# EAGLE design divchrono-aux (EAGLE 7.5.0)
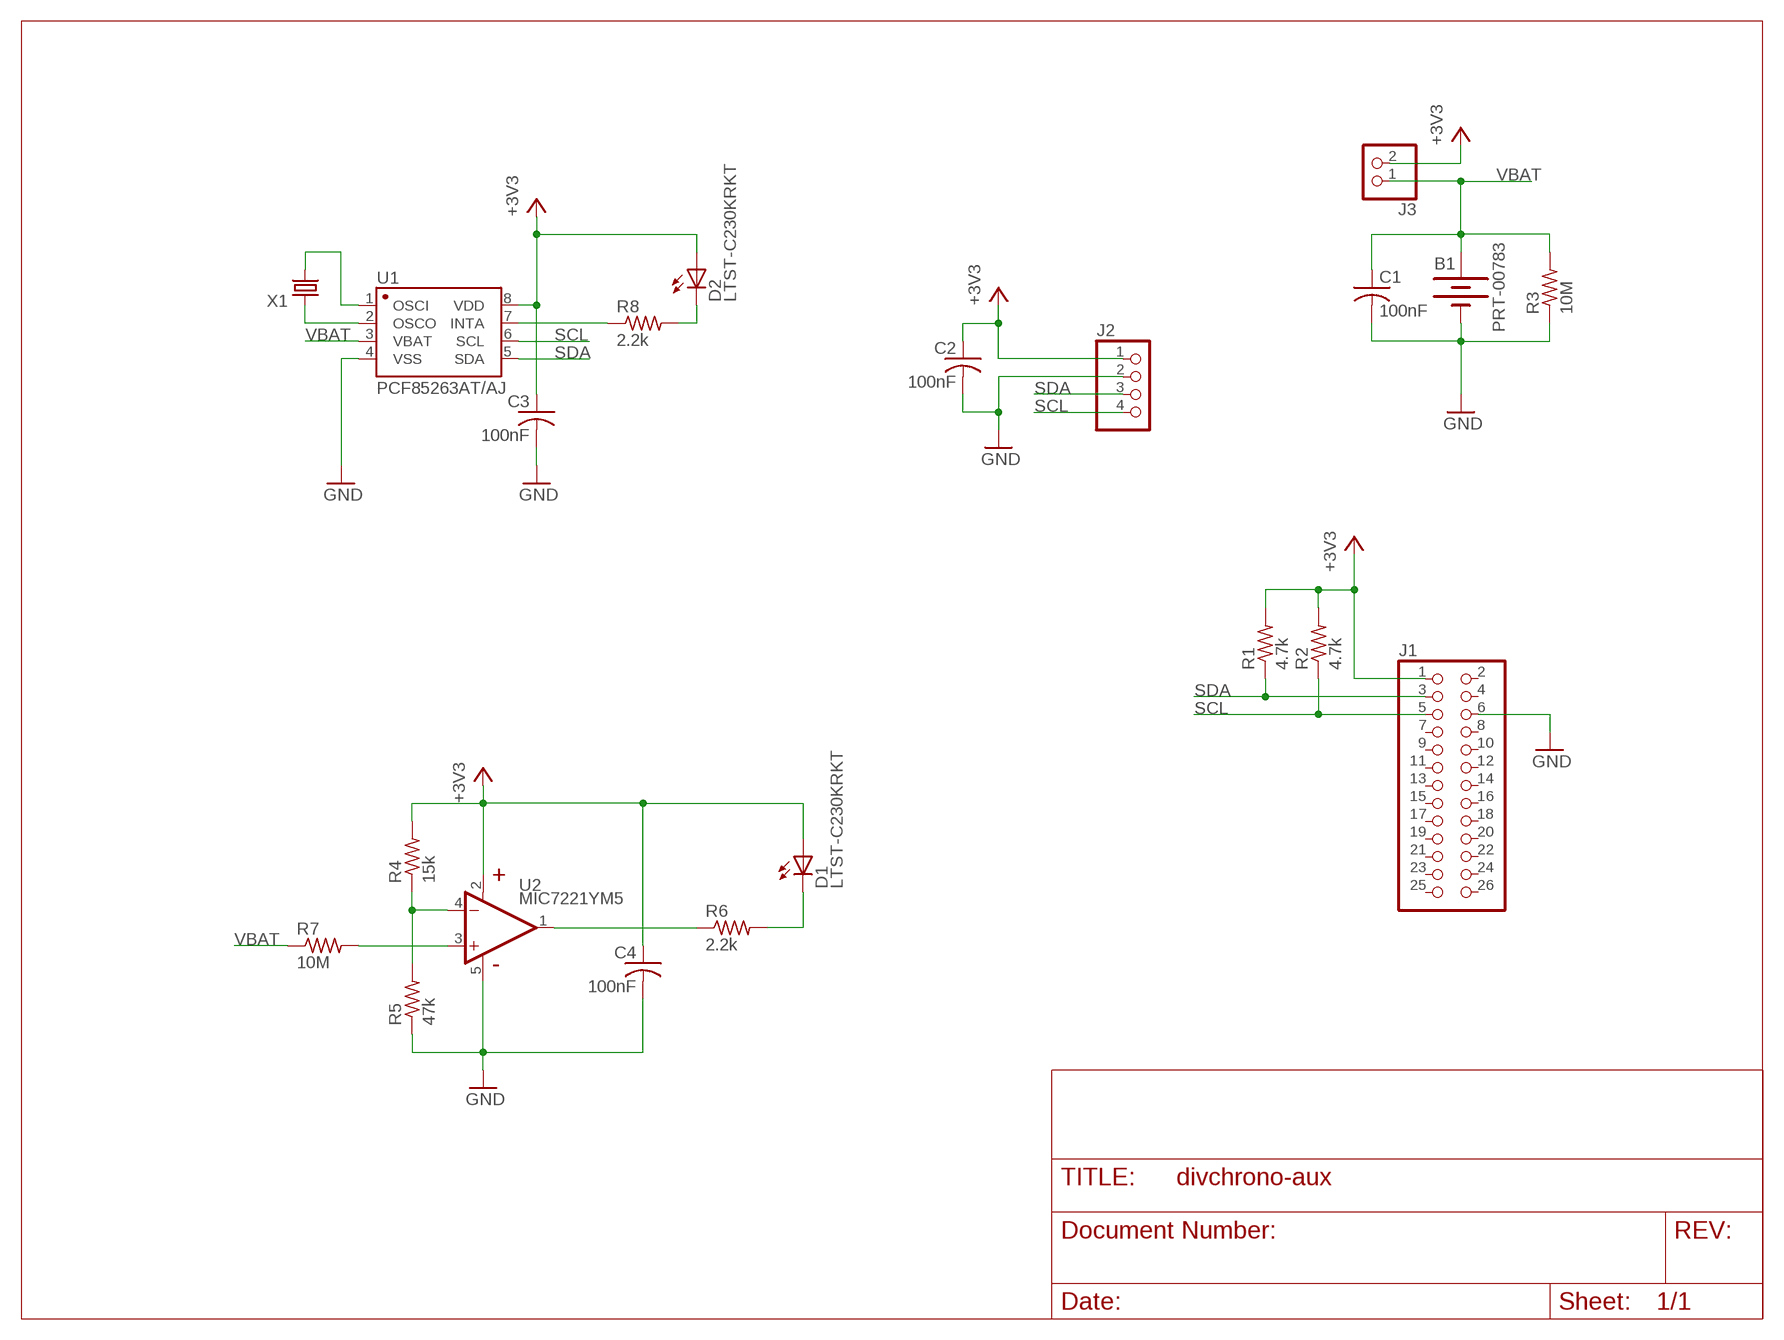
[diagram p0: schematic, sheet 1]

## Parts
B1  PRT-00783  BATTERY20PTH  [BATTCOM_20MM_PTH]
C1  100nF  C-USC1206  [C1206]
C2  100nF  C-USC1206  [C1206]
C3  100nF  C-USC1206  [C1206]
C4  100nF  C-USC1206  [C1206]
D1  LTST-C230KRKT  LEDCHIPLED_1206  [CHIPLED_1206]
D2  LTST-C230KRKT  LEDCHIPLED_1206  [CHIPLED_1206]
J1  PINHD-2X13  [2X13]
J2  PINHD-1X4  [1X04]
J3  PINHD-1X2  [1X02]
R1  4.7k  R-US_R1206  [R1206]
R2  4.7k  R-US_R1206  [R1206]
R3  10M  R-US_R1206  [R1206]
R4  15k  R-US_R1206  [R1206]
R5  47k  R-US_R1206  [R1206]
R6  2.2k  R-US_R1206  [R1206]
R7  10M  R-US_R1206  [R1206]
R8  2.2k  R-US_R1206  [R1206]
U1  PCF85263AT/AJ  PCF85263  [SOIC-8]
U2  MIC7221YM5  [SOT23-5]
X1  CRYSTALS-NOGND-WATCH-3X8  [WATCH-3X8]

## Nets
+3V3: C2.1 C3.1 C4.1 D1.A D2.A J1.1 J2.1 J3.2 R1.2 R2.2 R4.2 U1.8(VDD) U2.2(V+)
GND: B1.2(-) C1.2 C2.2 C3.2 C4.2 J1.6 J2.2 R3.1 R5.1 U1.4(VSS) U2.5(V-)
N$1: R6.1 U2.1(OUT)
N$2: R4.1 R5.2 U2.4(-IN)
N$3: D1.C R6.2
N$4: U1.2(OSCO) X1.1
N$5: U1.1(OSCI) X1.2
N$6: R7.2 U2.3(+IN)
N$7: D2.C R8.2
N$8: R8.1 U1.7(INTA)
SCL: J1.5 J2.4 R2.1 U1.6(SCL)
SDA: J1.3 J2.3 R1.1 U1.5(SDA)
VBAT: B1.1(+) C1.1 J3.1 R3.2 R7.1 U1.3(VBAT)
Unconnected: J1.2 J1.4 J1.7 J1.8 J1.9 J1.10 J1.11 J1.12 J1.13 J1.14 J1.15 J1.16 J1.17 J1.18 J1.19 J1.20 J1.21 J1.22 J1.23 J1.24 J1.25 J1.26

## Library data of the parts
B1 = SparkFun-Electromechanical:BATTERY: Battery Holders Various common sizes : AA, AAA, 18650 (PRT-12895), 20mm coin cell and 12mm coin cell. 20MM_4LEGS, BATT-10373
C1-C4 = rcl:C-US: CAPACITOR, American symbol
D1 D2 = led:LED: LED OSRAM: - CHIPLED LG R971, LG N971, LY N971, LG Q971, LY Q971, LO R971, LY R971 LH N974, LH R974 LS Q976, LO Q976, LY Q976 LO Q996 - Hyper CHIPLED LW Q18S LB Q993, LB Q99A, LB R99A - SideLED LS A670, LO A670, LY A670, LG A670, LP A670 LB A673, LV A673, LT A673, LW A673 LH A674 LY A675 LS A676, LA A676, LO A676, LY A676, LW A676 LS A679, LY A679, LG A679 - Hyper Micro SIDELED® LS Y876, LA Y876, LO Y876, LY Y876 LT Y87S - SmartLED LW L88C, LW L88S LB L89C, LB L89S, LG L890 LS L89K, LO L89K, LY L89K LS L896, LA L896, LO L896, LY L896 - TOPLED LS T670, LO T670, LY T670, LG T670, LP T670 LSG T670, LSP T670, LSY T670, LOP T670, LYG T670 LG T671, LOG T671, LSG T671 LB T673, LV T673, LT T673, LW T673 LH T674 LS T676, LA T676, LO T676, LY T676, LB T676, LH T676, LSB T676, LW T676 LB T67C, LV T67C, LT T67C, LS T67K, LO T67K, LY T67K, LW E67C LS E67B, LA E67B, LO E67B, LY E67B, LB E67C, LV E67C, LT E67C LW T67C LS T679, LY T679, LG T679 LS T770, LO T770, LY T770, LG T770, LP T770 LB T773, LV T773, LT T773, LW T773 LH T774 LS E675, LA E675, LY E675, LS T675 LS T776, LA T776, LO T776, LY T776, LB T776 LHGB T686 LT T68C, LB T68C - Hyper Mini TOPLED® LB M676 - Mini TOPLED Santana® LG M470 LS M47K, LO M47K, LY M47K Source: http://www.osram.convergy.de LUXEON: - LUMILED® LXK2-PW12-R00, LXK2-PW12-S00, LXK2-PW14-U00, LXK2-PW14-V00 LXK2-PM12-R00, LXK2-PM12-S00, LXK2-PM14-U00 LXK2-PE12-Q00, LXK2-PE12-R00, LXK2-PE12-S00, LXK2-PE14-T00, LXK2-PE14-U00 LXK2-PB12-K00, LXK2-PB12-L00, LXK2-PB12-M00, LXK2-PB14-N00, LXK2-PB14-P00, LXK2-PB14-Q00 LXK2-PR12-L00, LXK2-PR12-M00, LXK2-PR14-Q00, LXK2-PR14-R00 LXK2-PD12-Q00, LXK2-PD12-R00, LXK2-PD12-S00 LXK2-PH12-R00, LXK2-PH12-S00 LXK2-PL12-P00, LXK2-PL12-Q00, LXK2-PL12-R00 Source: www.luxeon.com KINGBRIGHT: KA-3528ASYC Source: www.kingbright.com
J1 = pinhead:PINHD-2X13: PIN HEADER
J2 = pinhead:PINHD-1X4: PIN HEADER
J3 = pinhead:PINHD-1X2: PIN HEADER
R1-R8 = rcl:R-US_: RESISTOR, American symbol
U1 = divchrono:PCF85263
U2 = divchrono:MIC7221YM5
X1 = pgrmcount:CRYSTALS-NOGND: CRYSTALS CAN NOT GROUNDED

## Board
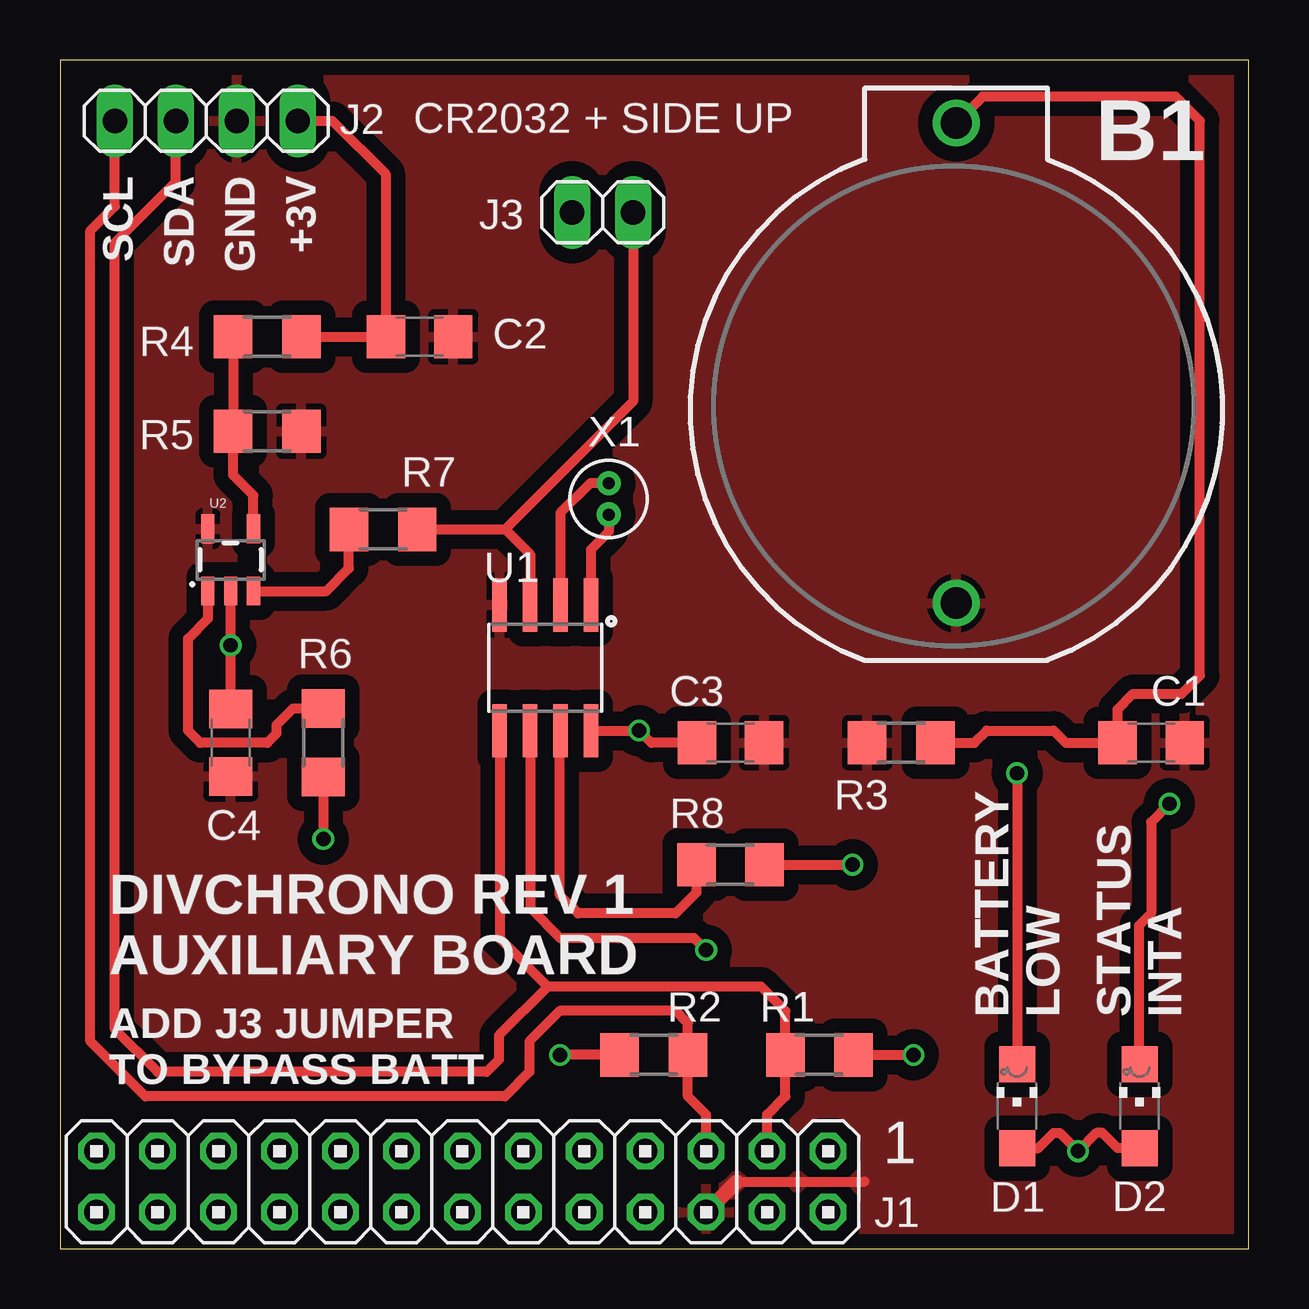
[diagram p1: board, top side]
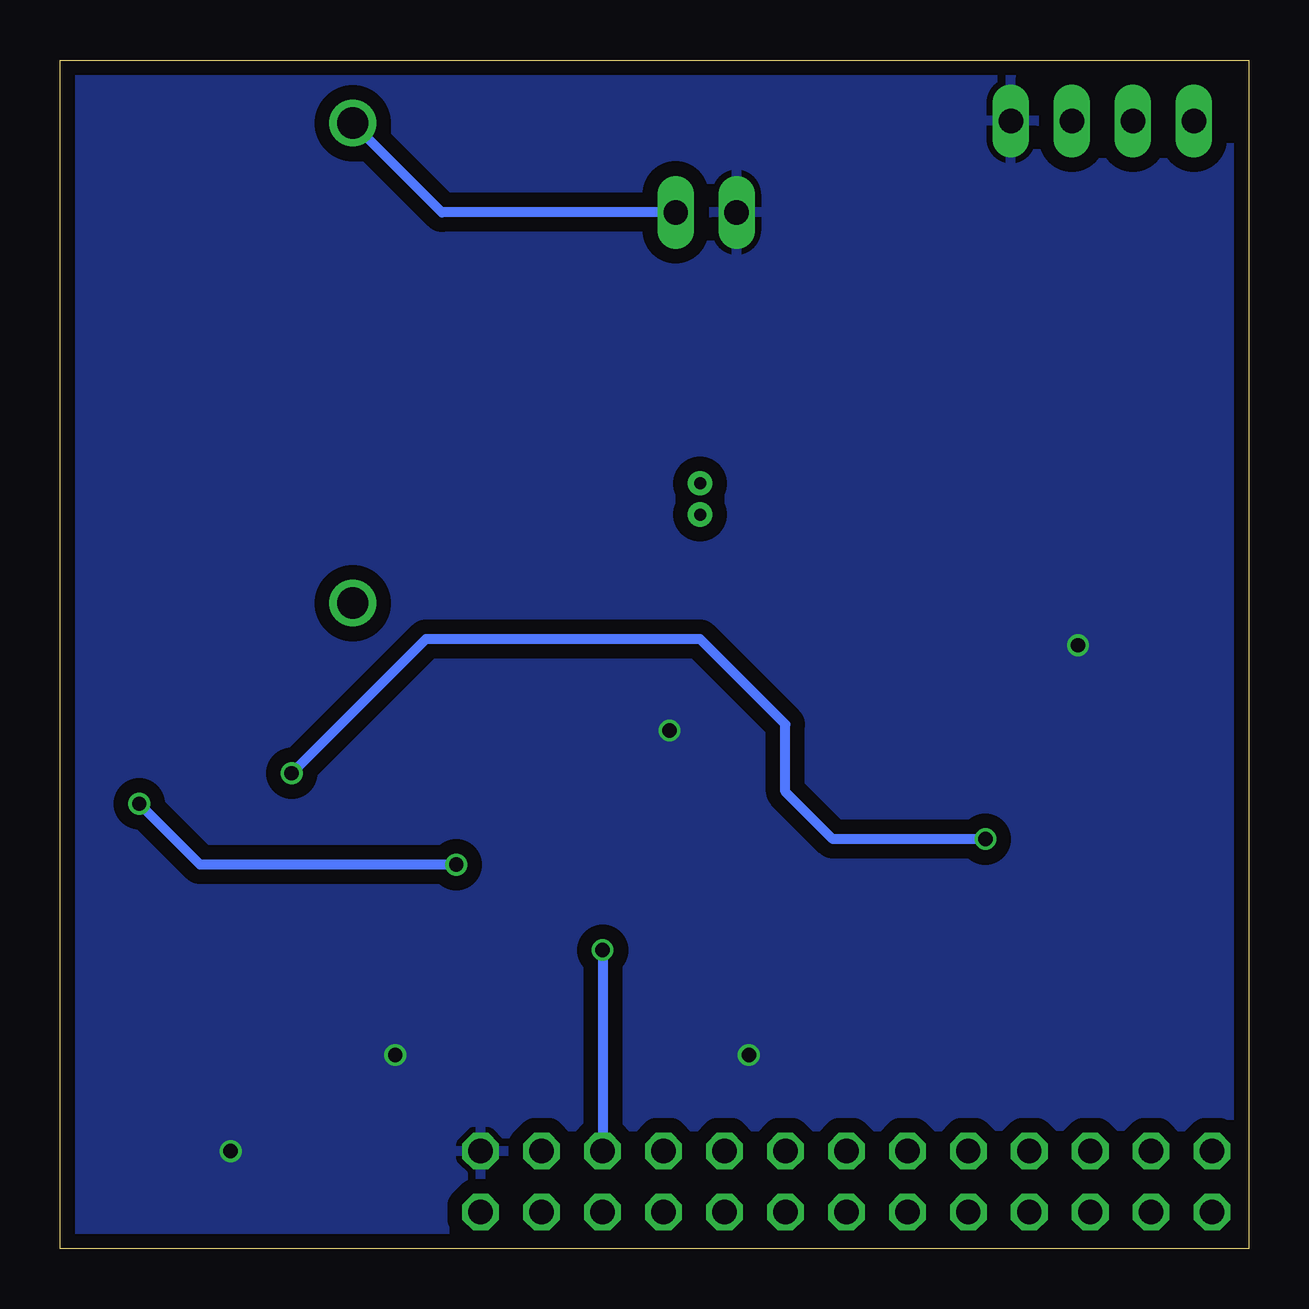
[diagram p2: board, bottom side, seen from below]

Size 49.53 x 49.53 mm. Coordinates in mm from the lower left corner, seen from the top.
Outline: 0,0 49.53,0 49.53,49.53 0,49.53 0,0
Copper layers (1*16): Top 0.035mm / dielectric 1.5mm / Bottom 0.035mm
Design rules "dirt_cheap_dirty_boards.v1": minimum track width 5mil, minimum drill 12mil, track to track 5mil, track to pad 5mil, pad to pad 5mil, via to via 5mil, smd to smd 0mil, copper to edge 10mil, drill to drill 10mil, minimum pad ring 10mil, minimum via ring 6mil, stop-mask expansion 2mil, vias tented up to drill 25mil, thermal gap 10mil

### Footprints (pad centres in the part's own frame; a part is rotated, then mirrored left to right if it is on the bottom)
BATTCOM_20MM_PTH = drill 1.3: 1 11.85,0; 2 -8.15,0
C1206 = smd 1.6 x 1.8: 1 -1.4,0; 2 1.4,0
CHIPLED_1206 = smd 1.5 x 1.5: A 0,-1.75; C 0,1.75
2X13 = drill 1.016 octagon: 1 -15.24,-1.27; 2 -15.24,1.27; 3 -12.7,-1.27; 4 -12.7,1.27; 5 -10.16,-1.27; 6 -10.16,1.27; 7 -7.62,-1.27; 8 -7.62,1.27; 9 -5.08,-1.27; 10 -5.08,1.27; 11 -2.54,-1.27; 12 -2.54,1.27; 13 0,-1.27; 14 0,1.27; 15 2.54,-1.27; 16 2.54,1.27; 17 5.08,-1.27; 18 5.08,1.27; 19 7.62,-1.27; 20 7.62,1.27; 21 10.16,-1.27; 22 10.16,1.27; 23 12.7,-1.27; 24 12.7,1.27; 25 15.24,-1.27; 26 15.24,1.27
1X04 = drill 1.016 long: 1 -3.81,0; 2 -1.27,0; 3 1.27,0; 4 3.81,0
1X02 = drill 1.016 long: 1 -1.27,0; 2 1.27,0
R1206 = smd 1.6 x 1.803: 1 -1.422,0; 2 1.422,0
SOIC-8 = smd 0.61 x 2.21: 1 -1.905,-2.616; 2 -0.635,-2.616; 3 0.635,-2.616; 4 1.905,-2.616; 5 1.905,2.616; 6 0.635,2.616; 7 -0.635,2.616; 8 -1.905,2.616
SOT23-5 = smd 0.55 x 1.2: 1 -0.95,-1.3; 2 0,-1.3; 3 0.95,-1.3; 4 0.95,1.3; 5 -0.95,1.3
WATCH-3X8 = drill 0.5 pad 0.813: 1 -0.652,0; 2 0.652,0

### Placement (x,y rotation side)
B1  37.34,35.05 90 top
C1  45.47,21.08 0 top
C2  14.99,38 0 top
C3  27.94,21.08 0 top
C4  7.11,21.08 270 top
D1  39.88,5.94 0 top
D2  44.98,5.94 0 top
J1  16.76,2.79 180 top
J2  6.1,46.99 180 top
J3  22.61,43.18 180 top
R1  31.65,8.08 0 top
R2  24.74,8.08 180 top
R3  35.05,21.08 0 top
R4  8.64,38 0 top
R5  8.64,34.06 180 top
R6  10.97,21.08 270 top
R7  13.46,29.97 180 top
R8  27.94,16 0 top
U1  20.22,24.21 180 top
U2  7.11,28.7 0 top
X1  22.86,31.24 270 top

### Tracks (layer width: path | path; a pad name or v marks a point on that pad's centre or on a via)
+3V3  (via drill 0.6)
  Top 0.406: R2.2 v20.83,8.08 | R1.2 v35.56,8.08 | U1.8 v24.13,21.59 24.64,21.08 C3.1 | C4.1 v7.11,25.15 U2.2 | R4.2 C2.1 13.56,38.02 13.56,44.78 11.35,46.99 J2.1 | D1.A 40.77,4.19 41.4,4.83 41.66,4.83 v42.42,4.06 43.18,4.83 43.43,4.83 44.07,4.19 D2.A
  pour Bottom (isolate 0.61): 0,49.53 0,0 49.53,0 49.53,49.53
GND
  Top 0.406: 28.19,2.79 33.53,2.79
  Top 0.61: J1.6 28.19,2.79
  pour Top (isolate 0.61): 0,49.53 49.53,49.53 49.53,0 0,0
N$1
  Top 0.406: R6.1 9.7,22.5 9.02,21.82 9.02,21.46 8.64,21.08 5.84,21.08 5.33,21.59 5.33,25.43 6.17,26.26 6.17,27.39 U2.1
N$2
  Top 0.406: R4.1 R5.2 | U2.4 8.06,31.38 7.21,32.23 R5.2 | R5.2
N$3  (via drill 0.6)
  Top 0.406: R6.2 v10.97,17.07 | v39.88,19.81 D1.C
  Bottom 0.406: v10.97,17.07 17.32,17.07 19.3,19.05 19.3,21.84 22.86,25.4 34.29,25.4 v39.88,19.81
N$4
  Top 0.406: X1.1 22.09,31.89 20.85,30.66 U1.2
N$5
  Top 0.406: X1.2 22.86,29.87 22.12,29.13 U1.1
N$6
  Top 0.406: U2.3 11.1,27.4 12.04,28.35 R7.2 | R7.2
N$7  (via drill 0.6)
  Top 0.406: R8.2 v33.02,16 | D2.C 44.96,7.72 44.96,13.46 45.47,13.97 45.47,17.78 v46.23,18.54
  Bottom 0.406: v33.02,16 43.69,16 v46.23,18.54
N$8
  Top 0.406: R8.1 26.52,14.83 25.65,13.97 21.59,13.97 20.83,14.73 20.83,21.57 U1.7
SCL  (via drill 0.6)
  Top 0.406: J1.5 26.92,5.59 26.16,6.35 R2.1 | R2.1 | J2.4 2.29,43.43 1.27,42.42 1.27,8.64 3.56,6.35 18.54,6.35 19.56,7.37 19.56,8.64 20.83,9.91 25.65,9.91 26.16,9.4 R2.1 | U1.6 19.58,14.2 20.83,12.95 26.42,12.95 v26.92,12.45
  Bottom 0.406: v26.92,12.45 J1.5
SDA
  Top 0.406: J1.3 29.46,5.59 30.23,6.35 R1.1 | R1.1 | J2.3 4.83,44.45 2.29,41.91 2.29,9.14 4.06,7.37 17.78,7.37 18.29,7.87 18.29,8.89 20.32,10.92 | R1.1 30.23,9.91 29.21,10.92 20.32,10.92 | U1.5 18.31,12.93 20.32,10.92
VBAT
  Top 0.406: C1.1 44.07,22.48 44.7,23.11 46.74,23.11 47.5,23.88 47.5,46.99 46.48,48.01 38.44,48.01 B1.1 | R7.1 18.54,29.97 | 18.54,29.97 19.58,28.93 U1.3 | 44.04,21.06 C1.1 | J3.1 23.88,35.31 18.54,29.97 | R3.2 38.1,21.08 38.61,21.59 41.4,21.59 41.91,21.08 C1.1
  Bottom 0.406: B1.1 33.62,43.18 J3.1

### Text on the board
tPlace: CR2032 + SIDE UP | SCL | SDA | GND | +3V | DIVCHRONO REV 1 / AUXILIARY BOARD | BATTERY / LOW | STATUS / INTA | ADD J3 JUMPER / TO BYPASS BATT | 1